# EAGLE design LED Bar (EAGLE 6.2)
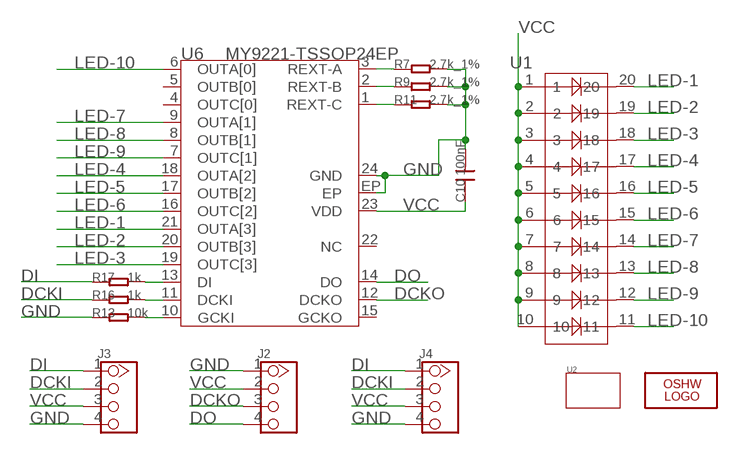
[diagram p0: schematic, sheet 1]

## Parts
C10  100nF  C-0603  [0603]
J2  HEADER-4P-90D  [4P-2.54-90]
J3  HEADER-4P'2.54-90D-FEMALE'  [4P-2.54-90D-FEMALE]
J4  TWIG-4P-2.0-2.0  [4P-2.0]
LOGO1  LOGO-OSHW-FILLX0150-NT  [OSHW_FILLX150_NOTEXT]
R7  2.7k_1%  R-0603  [0603]
R9  2.7k_1%  R-0603  [0603]
R11  2.7k_1%  R-0603  [0603]
R13  10k  R-0603  [0603]
R16  1k  R-0603  [0603]
R17  1k  R-0603  [0603]
U1  LED-20P  [20P-DIP-2.54-25.5X10.1X8.4H]
U2  TWIG-2U  [2U-DIM-W/-DRILL]
U6  MY9221-TSSOP24EP  [TSSOP24EP]

## Nets
DCKI: J3.2 J4.2 R16.1
DCKO: J2.3 U6.12(DCKO)
DI: J3.1 J4.1 R17.1
DO: J2.4 U6.14(DO)
GND: C10.2 J2.1 J3.4 J4.4 R7.2 R9.2 R11.2 R13.1 U6.24(GND) U6.EP
LED-1: U1.20 U6.21(OUTA[3])
LED-2: U1.19 U6.20(OUTB[3])
LED-3: U1.18 U6.19(OUTC[3])
LED-4: U1.17 U6.18(OUTA[2])
LED-5: U1.16 U6.17(OUTB[2])
LED-6: U1.15 U6.16(OUTC[2])
LED-7: U1.14 U6.9(OUTA[1])
LED-8: U1.13 U6.8(OUTB[1])
LED-9: U1.12 U6.7(OUTC[1])
LED-10: U1.11 U6.6(OUTA[0])
N$1: R17.2 U6.13(DI)
N$2: R16.2 U6.11(DCKI)
N$4: R13.2 U6.10(GCKI)
N$7: R11.1 U6.1(REXT-C)
N$8: R9.1 U6.2(REXT-B)
N$9: R7.1 U6.3(REXT-A)
VCC: C10.1 J2.2 J3.3 J4.3 U1.1 U1.2 U1.3 U1.4 U1.5 U1.6 U1.7 U1.8 U1.9 U1.10 U6.23(VDD)
Unconnected: U6.4(OUTC[0]) U6.5(OUTB[0]) U6.15(GCKO) U6.22(NC)

## Library data of the parts
C10 = Discrete:C*: Ceramic Capacitors
J2 J3 = Connector:HEADER-4P
J4 = Connector:TWIG-4P-2.0
LOGO1 = Logo:LOGO-OSHW-FILL
R7 R9 R11 R13 R16 R17 = Discrete:R*
U1 = Module:LED-20P
U2 = Module:TWIG
U6 = For_Test_Albert:MY9221

## Net classes
0 default: width 0.203 mm, drill 0.305 mm, clearance 0.152 mm

## Board
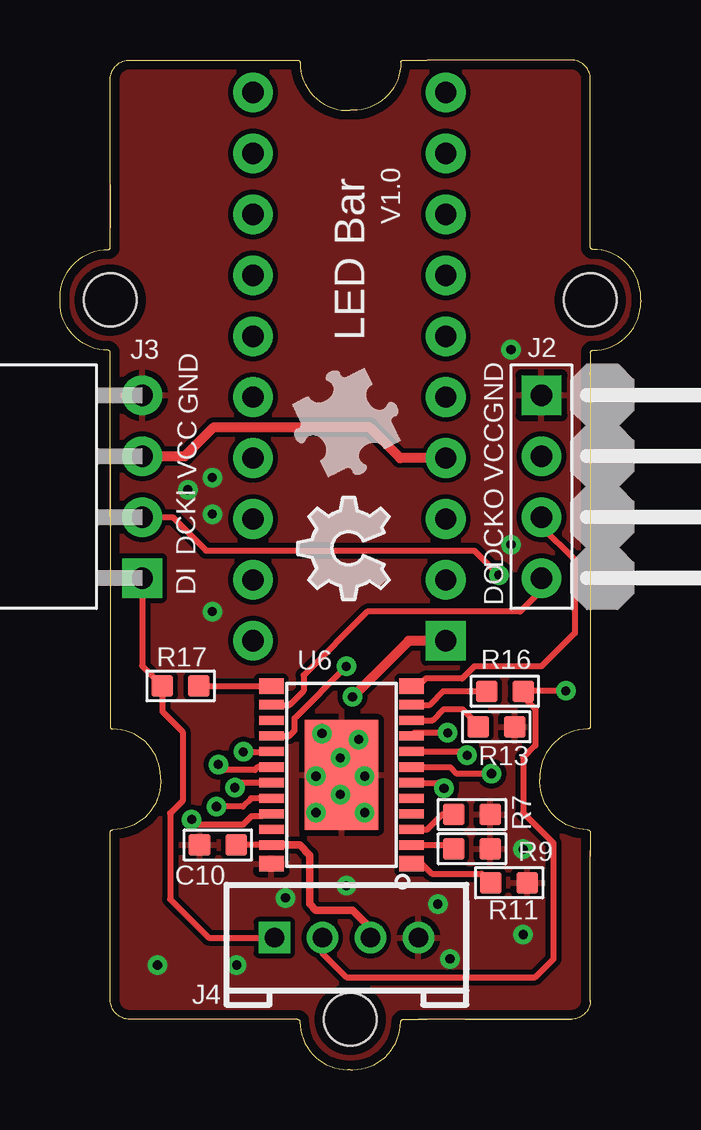
[diagram p1: board, top side]
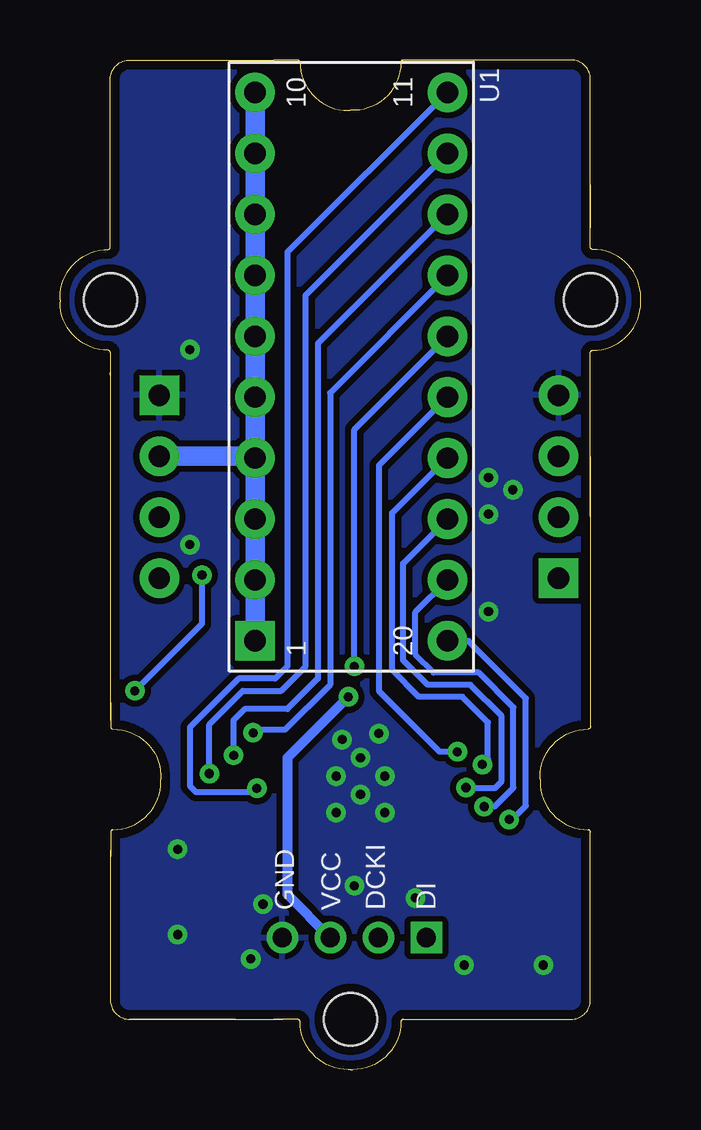
[diagram p2: board, bottom side, seen from below]

Size 24.2 x 42.09 mm. Coordinates in mm from the lower left corner, seen from the top.
Copper layers (1*16): Top 0.035mm / dielectric 1.5mm / Bottom 0.035mm
Design rules: minimum track width 10mil, minimum drill 12mil, track to track 8mil, track to pad 8mil, pad to pad 8mil, via to via 8mil, smd to smd 8mil, copper to edge 15mil, drill to drill 8mil, minimum pad ring 10mil, minimum via ring 8mil, stop-mask expansion 4mil, vias tented up to drill 25mil, thermal gap 10mil

### Footprints (pad centres in the part's own frame; a part is rotated, then mirrored left to right if it is on the bottom)
0603 = smd 0.889 x 0.889: 1 -0.762,0; 2 0.762,0
4P-2.54-90 = drill 0.889 pad 1.651 square: 1 0,3.81 | drill 0.889 pad 1.651: 2 0,1.27; 3 0,-1.27; 4 0,-3.81
4P-2.54-90D-FEMALE = drill 0.889 pad 1.651 square: 1 0,3.81 | drill 0.889 pad 1.651: 2 0,1.27; 3 0,-1.27; 4 0,-3.81
4P-2.0 = drill 0.8 pad 1.27 square: 1 -3,0 | drill 0.8 pad 1.27: 2 -1,0; 3 1,0; 4 3,0
20P-DIP-2.54-25.5X10.1X8.4H = drill 0.889 pad 1.651 square: 1 -11.43,4.013 | drill 0.889 pad 1.651: 2 -8.89,4.013; 3 -6.35,4.013; 4 -3.81,4.013; 5 -1.27,4.013; 6 1.27,4.013; 7 3.81,4.013; 8 6.35,4.013; 9 8.89,4.013; 10 11.43,4.013; 11 11.43,-4.013; 12 8.89,-4.013; 13 6.35,-4.013; 14 3.81,-4.013; 15 1.27,-4.013; 16 -1.27,-4.013; 17 -3.81,-4.013; 18 -6.35,-4.013; 19 -8.89,-4.013; 20 -11.43,-4.013
2U-DIM-W/-DRILL = hole 2.2: 10.453,-10.42; 10.453,9.58; -19.535,-0.415
TSSOP24EP = smd 0.635 x 1.016: 1 -3.702,-2.921; 12 3.702,-2.921; 13 3.702,2.921; 24 -3.702,2.921 | smd 0.381 x 1.016: 2 -2.925,-2.921; 3 -2.275,-2.921; 4 -1.625,-2.921; 5 -0.975,-2.921; 6 -0.325,-2.921; 7 0.325,-2.921; 8 0.975,-2.921; 9 1.625,-2.921; 10 2.275,-2.921; 11 2.925,-2.921; 14 2.925,2.921; 15 2.275,2.921; 16 1.625,2.921; 17 0.975,2.921; 18 0.325,2.921; 19 -0.325,2.921; 20 -0.975,2.921; 21 -1.625,2.921; 22 -2.275,2.921; 23 -2.925,2.921 | smd 4.572 x 3.048: EP 0,0

### Placement (x,y rotation side)
C10  6.57,9.37 180 top
J2  20.06,24.3 0 top
J3  3.43,24.3 180 top
J4  11.93,5.51 0 top
LOGO1  13.71,19.6 90 top
R7  17.17,10.64 0 top
R9  17.17,9.21 0 top
R11  18.72,7.79 0 top
R13  18.18,14.29 180 top
R16  18.54,15.77 180 top
R17  5.03,16 0 top
U1  12.06,29.31 90 bottom
U2  11.68,21.64 90 top
U6  11.73,12.29 90 top
U$2  [BRICK-LOGO-MIL-0.5]  9.39,24.43 0 top

### Tracks (layer width: path | path; a pad name or v marks a point on that pad's centre or on a via)
DCKI  (via drill 0.38 pad 0.81)
  Top 0.254: J4.2 10.93,4.86 11.93,3.86 19.81,3.86 20.57,4.62 20.57,9.44 19.3,10.71 19.3,13 19.81,13.51 19.81,15.03 19.3,15.54 R16.1 19.33,15.79 v21.08,15.79 | J3.2 4.7,23.03 6.09,21.64 17.27,21.64 v18.28,20.62
  Bottom 0.254: v18.28,20.62 18.28,18.59 v21.08,15.79
DCKO
  Top 0.254: U6.12 14.93,15.99 15.24,16.3 16.76,16.3 17.27,16.81 20.06,16.81 21.45,18.2 21.45,21.26 20.06,22.65 J2.3
DI
  Top 0.254: J3.1 3.43,16.83 R17.1 4.26,14.93 5.11,14.09 5.11,11.2 4.59,10.68 4.59,7.11 6.19,5.51 J4.1
DO
  Top 0.254: J2.4 20.06,19.98 19.17,19.09 12.81,19.09 10.16,16.44 10.16,15.79 9.58,15.21 U6.14
GND  (via drill 0.38 pad 0.81)
  other vias: 19.3,5.63 18.79,30.02 9.39,7.16 10.66,10.71 12.7,10.71 11.68,11.48 12.7,12.24 10.66,12.24 10.92,14.02 11.68,13 11.93,7.67 4.06,4.36 7.36,4.36 6.35,24.68 6.35,23.16 5.33,24.18 12.44,13.76 15.74,6.9 19.3,9.19 16.25,4.62 18.79,21.89 6.35,19.09
  pour Bottom (isolate 0.254): -0.38,42.21 24.38,42.21 24.38,0.05 -0.38,0.05
  pour Top: -0.38,42.21 24.38,42.21 24.38,0.05 -0.38,0.05
LED-1  (via drill 0.38 pad 0.81)
  Top 0.254: U6.21 8.51,10.66 8.4,10.56 7.97,10.56 7.62,10.21 5.71,10.21 v5.48,10.43
  Bottom 0.254: v5.48,10.43 5.36,10.43 4.79,11 4.79,15.48 7.19,17.88 U1.20
LED-2  (via drill 0.38 pad 0.81)
  Top 0.254: U6.20 7.96,11.31 7.62,10.97 v6.52,10.97
  Bottom 0.254: v6.52,10.97 6.09,10.97 5.31,11.75 5.31,15.1 6.76,16.56 8.63,16.56 9.39,17.32 9.39,19.07 U1.19
LED-3  (via drill 0.38 pad 0.81)
  Top 0.254: U6.19 7.49,11.96 v7.29,11.75
  Bottom 0.254: v7.29,11.75 7.26,11.73 6.09,11.73 5.79,12.03 5.79,14.74 7.1,16.05 8.89,16.05 9.9,17.06 9.9,21.1 U1.18
LED-4  (via drill 0.38 pad 0.81)
  Top 0.254: 8.79,12.59 U6.18 8.25,12.61 8.12,12.49 6.83,12.49 v6.6,12.72
  Bottom 0.254: v6.6,12.72 6.6,12.75 6.37,12.97 6.37,14.48 7.43,15.54 9.25,15.54 10.36,16.65 10.36,23.21 8.07,25.5 U1.17
LED-5  (via drill 0.38 pad 0.81)
  Top 0.254: v7.64,13.25 8.8,13.25 U6.17
  Bottom 0.254: U1.16 8.07,28.04 10.92,25.19 10.92,15.79 8.38,13.25 v7.64,13.25
LED-6  (via drill 0.38 pad 0.81)
  Top 0.254: U6.16 | U6.16 9.55,13.91 9.78,14.14 9.78,14.65 v11.93,16.81
  Bottom 0.254: v11.93,16.81 11.93,26.69 U1.15
LED-7  (via drill 0.38 pad 0.81)
  Top 0.254: v16.15,14.04 14.78,14.04 U6.9
  Bottom 0.254: U1.14 12.95,28.21 12.95,16.04 14.83,14.17 16.02,14.17 v16.15,14.04
LED-8  (via drill 0.38 pad 0.81)
  Top 0.254: U6.8 16.8,13.26 v16.96,13.1
  Bottom 0.254: U1.13 8.05,35.68 13.46,30.27 13.46,16.3 14.73,15.03 16.51,15.03 16.96,14.57 v16.96,13.1
LED-9  (via drill 0.38 pad 0.81)
  Top 0.254: U6.7 16.26,12.61 16.53,12.34 v17.98,12.34
  Bottom 0.254: v17.98,12.34 17.98,14.39 16.58,15.79 14.98,15.79 13.97,16.81 13.97,32.28 U1.12
LED-10  (via drill 0.38 pad 0.81)
  Top 0.254: 15.82,11.93 16,11.75 v16,11.73 15.76,11.96 U6.6
  Bottom 0.254: U1.11 8.07,40.74 14.73,34.08 14.73,16.81 15.24,16.3 16.76,16.3 18.79,14.27 18.79,11.83 18.54,11.58 16.15,11.58 v16,11.73
N$1
  Top 0.254: R17.2 U6.13
N$2
  Top 0.254: R16.2 15.97,15.77 15.42,15.21 U6.11
N$4
  Top 0.254: U6.10 15.53,14.56 16,15.03 16.76,15.03 17.42,14.37 R13.2
N$7
  Top 0.254: U6.1 15.08,8.59 15.49,8.17 17.57,8.17 R11.1
N$8
  Top 0.254: U6.2 16.26,9.36 R9.1
N$9
  Top 0.254: R7.1 15.92,10.64 15.3,10.01 U6.3
VCC  (via drill 0.38 pad 0.81)
  Top 0.254: U6.23 C10.1
  Top 0.305: U6.23 9.98,9.36 10.41,8.94 10.41,6.9 10.66,6.65 12.19,6.65 12.95,5.89 12.95,5.52 J4.3
  Top 0.406: J3.3 5.2,25.57 6.41,26.78 12.88,26.78 14.17,25.5 U1.4 | U1.1 14.53,17.88 v12.19,15.54
  Bottom 0.406: v12.19,15.54 14.73,13 14.73,7.3 J4.3
  Bottom 0.813: U1.10 U1.9 U1.8 U1.7 U1.6 U1.5 U1.4 | U1.4 U1.3 U1.2 U1.1 | J2.2 16.15,25.57 U1.4

### Text on the board
tPlace: V1.0 | LED Bar | GND | GND | VCC | VCC | DCKO | DCKI | DI | DO
bPlace: DI | DCKI | VCC | GND